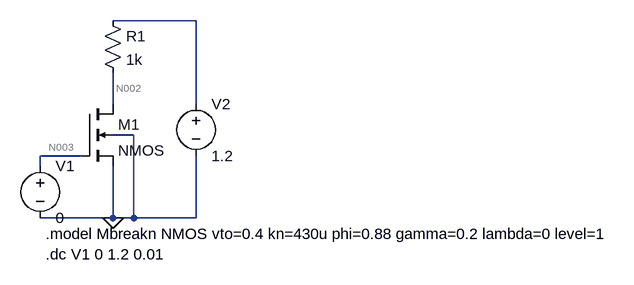
[diagram p0: schematic Lab02Part3.asc]
Lab02Part3.asc, the LTspice schematic file:
Version 4
SHEET 1 1016 680
WIRE 288 -64 160 -64
WIRE 160 64 160 16
WIRE 288 64 288 -64
WIRE 192 112 160 112
WIRE 112 144 48 144
WIRE 48 160 48 144
WIRE 160 240 160 160
WIRE 160 240 48 240
WIRE 192 240 192 112
WIRE 192 240 160 240
WIRE 288 240 288 144
WIRE 288 240 192 240
FLAG 160 240 0
SYMBOL nmos4 112 64 R0
SYMATTR InstName M1
SYMATTR Value2 l=0.1u w=25u
SYMBOL voltage 48 144 R0
WINDOW 123 0 0 Left 0
WINDOW 39 0 0 Left 0
SYMATTR InstName V1
SYMATTR Value 0
SYMBOL voltage 288 48 R0
WINDOW 123 0 0 Left 0
WINDOW 39 0 0 Left 0
SYMATTR InstName V2
SYMATTR Value 1.2
SYMBOL res 144 -80 R0
SYMATTR InstName R1
SYMATTR Value 1k
TEXT 56 264 Left 2 !.model Mbreakn NMOS vto=0.4 kn=430u phi=0.88 gamma=0.2 lambda=0 level=1
TEXT 56 296 Left 2 !.dc V1 0 1.2 0.01

The netlist it stands for:
* Lab02Part3.asc
M1 N002 N003 0 0 NMOS l=0.1u w=25u
V1 N003 0 0
V2 N001 0 1.2
R1 N001 N002 1k
.model NMOS NMOS
.model PMOS PMOS
.lib standard.mos
.model Mbreakn NMOS vto=0.4 kn=430u phi=0.88 gamma=0.2 lambda=0 level=1
.dc V1 0 1.2 0.01
.backanno
.end

* Results of the author's LTspice run, read from the files saved beside the schematic
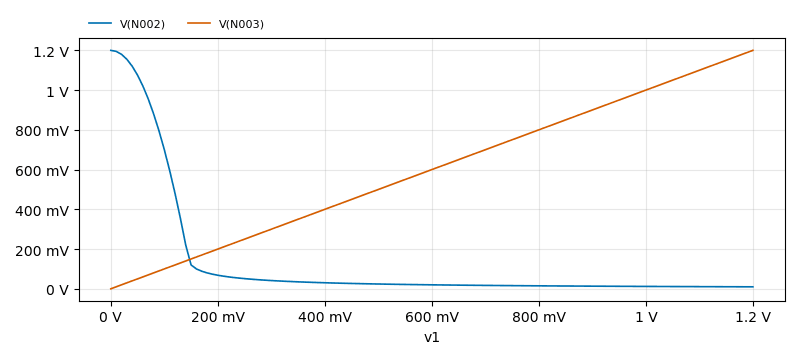
[diagram p1: DC transfer characteristic of Lab02Part3.asc, plotted from the saved traces]
* DC transfer characteristic, 1 run:
*   V(N002): 1.2 V at v1=0 V, 9.958 mV at v1=1.2 V, min 9.958 mV, max 1.2 V
*   V(N003): 0 V at v1=0 V, 1.2 V at v1=1.2 V, min 0 V, max 1.2 V